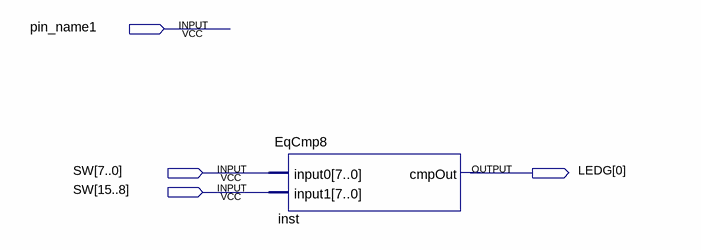
[diagram p0: schematic sheet]
// Quartus schematic EqCmpDemo.bdf as structural Verilog: 1 symbols, 4 pins
module EqCmpDemo (
  input  pin_name1,
  input  [15:0] SW,
  output [0:0] LEDG
);

  EqCmp8 inst (.input0(SW[7:0]), .input1(SW[15:8]));  // open: cmpOut
endmodule
